# Altium project PCB_Project2.PrjPCB
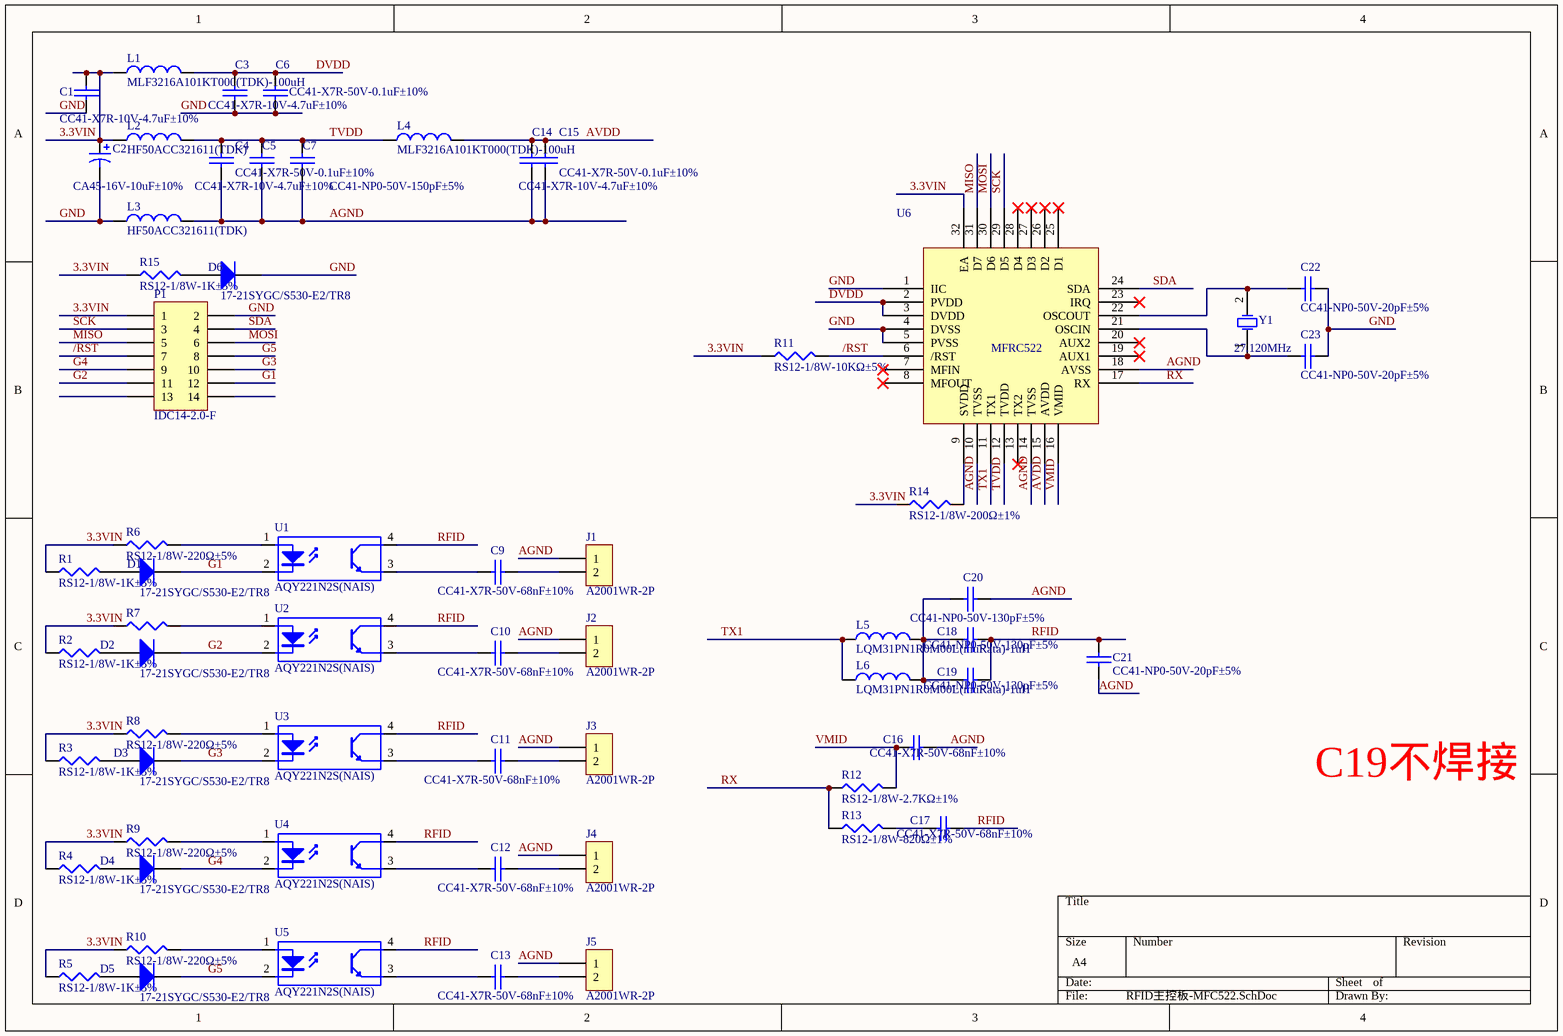
[diagram p0: RFID主控板-MFC522.SchDoc]
1 sheet, 62 parts. Net scope: global (net labels, ports and power ports of the same name join across sheets).
Board file: RFID主控板-MFC522.PcbDoc

## Sheet RFID主控板-MFC522.SchDoc
size A4

### Parts
C1  CC41-X7R-10V-4.7uF±10%  [1206C]
C2  CA45-16V-10uF±10%  [3216-A]
C3  CC41-X7R-10V-4.7uF±10%  [1206C]
C4  CC41-X7R-10V-4.7uF±10%  [1206C]
C5  CC41-X7R-50V-0.1uF±10%  [0805C]
C6  CC41-X7R-50V-0.1uF±10%  [0805C]
C7  CC41-NP0-50V-150pF±5%  [0805C]
C9  CC41-X7R-50V-68nF±10%  [0805C]
C10  CC41-X7R-50V-68nF±10%  [0805C]
C11  CC41-X7R-50V-68nF±10%  [0805C]
C12  CC41-X7R-50V-68nF±10%  [0805C]
C13  CC41-X7R-50V-68nF±10%  [0805C]
C14  CC41-X7R-10V-4.7uF±10%  [1206C]
C15  CC41-X7R-50V-0.1uF±10%  [0805C]
C16  CC41-X7R-50V-68nF±10%  [0805C]
C17  CC41-X7R-50V-68nF±10%  [0805C]
C18  CC41-NP0-50V-130pF±5%  [0805C]
C19  CC41-NP0-50V-130pF±5%  [0805C]
C20  CC41-NP0-50V-130pF±5%  [0805C]
C21  CC41-NP0-50V-20pF±5%  [0805C]
C22  CC41-NP0-50V-20pF±5%  [0805C]
C23  CC41-NP0-50V-20pF±5%  [0805C]
D1  17-21SYGC/S530-E2/TR8  [0805D]
D2  17-21SYGC/S530-E2/TR8  [0805D]
D3  17-21SYGC/S530-E2/TR8  [0805D]
D4  17-21SYGC/S530-E2/TR8  [0805D]
D5  17-21SYGC/S530-E2/TR8  [0805D]
D6  17-21SYGC/S530-E2/TR8  [0805D]
J1  A2001WR-2P  [A2001WR-2P]
J2  A2001WR-2P  [A2001WR-2P]
J3  A2001WR-2P  [A2001WR-2P]
J4  A2001WR-2P  [A2001WR-2P]
J5  A2001WR-2P  [A2001WR-2P]
L1  MLF3216A101KT000(TDK)-100uH  [1206L]
L2  HF50ACC321611(TDK)  [1206L]
L3  HF50ACC321611(TDK)  [1206L]
L4  MLF3216A101KT000(TDK)-100uH  [1206L]
L5  LQM31PN1R0M00L(muRata)-1uH  [1206L]
L6  LQM31PN1R0M00L(muRata)-1uH  [1206L]
P1  IDC14-2.0-F  [IDC14-2.0-F]
R1  RS12-1/8W-1K±5%  [0805R]
R2  RS12-1/8W-1K±5%  [0805R]
R3  RS12-1/8W-1K±5%  [0805R]
R4  RS12-1/8W-1K±5%  [0805R]
R5  RS12-1/8W-1K±5%  [0805R]
R6  RS12-1/8W-220Ω±5%  [0805R]
R7  RS12-1/8W-220Ω±5%  [0805R]  (value not drawn)
R8  RS12-1/8W-220Ω±5%  [0805R]
R9  RS12-1/8W-220Ω±5%  [0805R]
R10  RS12-1/8W-220Ω±5%  [0805R]
R11  RS12-1/8W-10KΩ±5%  [0805R]
R12  RS12-1/8W-2.7KΩ±1%  [0805R]
R13  RS12-1/8W-820Ω±1%  [0805R]
R14  RS12-1/8W-200Ω±1%  [0805R]
R15  RS12-1/8W-1K±5%  [0805R]
U1  AQY221N2S(NAIS)  [SOP-4]
U2  AQY221N2S(NAIS)  [SOP-4]
U3  AQY221N2S(NAIS)  [SOP-4]
U4  AQY221N2S(NAIS)  [SOP-4]
U5  AQY221N2S(NAIS)  [SOP-4]
U6  MFRC522  [QFN-32]
Y1  27.120MHz  [HC-49/CMD]

### Nets
3.3VIN: C1.2 C2.1 L1.1 L2.1 P1.1 R1.1 R2.1 R3.1 R4.1 R5.1 R6.1 R7.1 R8.1 R9.1 R10.1 R11.1 R14.1 R15.1 U6.32(EA)
/RST: P1.7 R11.2 U6.6(/RST)
AGND: C4.1 C5.1 C7.1 C14.1 C15.1 C16.2 C20.2 C21.1 J1.1 J2.1 J3.1 J4.1 J5.1 L3.2 U6.10(TVSS) U6.14(TVSS) U6.18(AVSS)
AVDD: C14.2 C15.2 L4.2 U6.15(AVDD)
DVDD: C3.2 C6.2 L1.2 U6.2(PVDD) U6.3(DVDD)
G1: D1.2(K) P1.12 U1.2(K)
G2: D2.2(K) P1.11 U2.2(K)
G3: D3.2(K) P1.10 U3.2(K)
G4: D4.2(K) P1.9 U4.2(K)
G5: D5.2(K) P1.8 U5.2(K)
GND: C1.1 C2.2 C3.1 C6.1 C22.1 C23.1 D6.2(K) L3.1 P1.2 U6.1(IIC) U6.4(DVSS) U6.5(PVSS)
MISO: P1.5 U6.31(D7)
MOSI: P1.6 U6.30(D6)
RFID: C17.2 C18.2 C19.2 C21.2 U1.4(C) U2.4(C) U3.4(C) U4.4(C) U5.4(C)
RX: R12.1 R13.1 U6.17(RX)
SCK: P1.3 U6.29(D5)
SDA: P1.4 U6.24(SDA)
TVDD: C4.2 C5.2 C7.2 L2.2 L4.1 U6.12(TVDD)
TX1: L5.1 L6.1 U6.11(TX1)
VMID: C16.1 R12.2 U6.16(VMID)
NetC9_1: C9.1 U1.3(E)
NetC9_2: C9.2 J1.2
NetC10_1: C10.1 U2.3(E)
NetC10_2: C10.2 J2.2
NetC11_1: C11.1 U3.3(E)
NetC11_2: C11.2 J3.2
NetC12_1: C12.1 U4.3(E)
NetC12_2: C12.2 J4.2
NetC13_1: C13.1 U5.3(E)
NetC13_2: C13.2 J5.2
NetC17_1: C17.1 R13.2
NetC18_1: C18.1 C19.1 C20.1 L5.2 L6.2
NetC22_2: C22.2 U6.22(OSCOUT) Y1.2(OSC2)
NetC23_2: C23.2 U6.21(OSCIN) Y1.1(OSC1)
NetD1_1: D1.1(A) R1.2
NetD2_1: D2.1(A) R2.2
NetD3_1: D3.1(A) R3.2
NetD4_1: D4.1(A) R4.2
NetD5_1: D5.1(A) R5.2
NetD6_1: D6.1(A) R15.2
NetR6_2: R6.2 U1.1(A)
NetR7_2: R7.2 U2.1(A)
NetR8_2: R8.2 U3.1(A)
NetR9_2: R9.2 U4.1(A)
NetR10_2: R10.2 U5.1(A)
NetR14_2: R14.2 U6.9(SVDD)

Not connected (* = marked no-connect by the designer): P1 13 14; U6 7(MFIN)* 8(MFOUT)* 13(TX2)* 19(AUX1)* 20(AUX2)* 23(IRQ)* 25(D1)* 26(D2)* 27(D3)* 28(D4)*

### Notes on the sheet
- C19不焊接

### Library data of the parts
C1 C3-C7 C9-C23 = CAP: Capacitor
C2 = Cap Pol1: Polarized Capacitor (Radial); Published: 8-Jun-2000; LatestRevisionDate: 17-Jul-2002; LatestRevisionNote: Re-released for DXP Platform.; PackageReference: RB7.6-15; Publisher: Altium Limited; PackageDescription: Polarized Capacitor (Radial); 2 Leads; Value: CA45-16V-10uF±10%
D1-D6 = Diode: Default Diode; Published: 8-Jun-2000; LatestRevisionDate: 17-Jul-2002; LatestRevisionNote: Re-released for DXP Platform.; PackageVersion: Sep-1996; PackageReference: SMC; Publisher: Altium Limited; PackageDescription: DO-214-AB/SMC; 2 C-Bend Leads; Body 7.9 x 5.9 mm, inc. leads (LxW); Code_JEDEC: DO-214-AB
J1-J5 = CON2
L1-L6 = Inductor: Code_IEC: 1005; Published: 8-Jun-2000; LatestRevisionDate: 29-May-2009; LatestRevisionNote: IPC-7351 Footprint Added.; PackageReference: 0402-A; Publisher: Altium Limited; PackageDescription: Chip Inductor; Code_JEITA: 0402
  L1 L4: Value: MLF3216A101KT000(TDK)-100uH
  L2 L3: Value: HF50ACC321611(TDK)
  L5 L6: Value: LQM31PN1R0M00L(muRata)-1uH
P1 = Header 7X2H: Header, 7-Pin, Dual row, Right Angle; LatestRevisionDate: 17-Jul-2002; LatestRevisionNote: Re-released for DXP Platform.; Publisher: Altium Limited
R1-R15 = Res3: Resistor; Published: 8-Jun-2000; LatestRevisionDate: 29-May-2009; LatestRevisionNote: IPC-7351 Footprint Added.; PackageReference: J1-0603; Publisher: Altium Limited; PackageDescription: Chip Resistor
  R1-R5 R15: Value: RS12-1/8W-1K±5%
  R6-R10: Value: RS12-1/8W-220Ω±5%
  R11: Value: RS12-1/8W-10KΩ±5%
  R12: Value: RS12-1/8W-2.7KΩ±1%
  R13: Value: RS12-1/8W-820Ω±1%
  R14: Value: RS12-1/8W-200Ω±1%
U1-U5 = OpticalCoupler
U6 = RC522
Y1 = XTAL: Crystal Oscillator; Published: 8-Jun-2000; LatestRevisionDate: 17-Jul-2002; LatestRevisionNote: Re-released for DXP Platform.; PackageReference: R38; Publisher: Altium Limited; PackageDescription: Crystal, Thru-Hole; 2 Leads; Body 3.1 x 8.2 mm (Dia.xH)